# Altium schematic sheet LoRa-SX1281.SchDoc
size A3; SheetNumber: 4; SheetTotal: 5
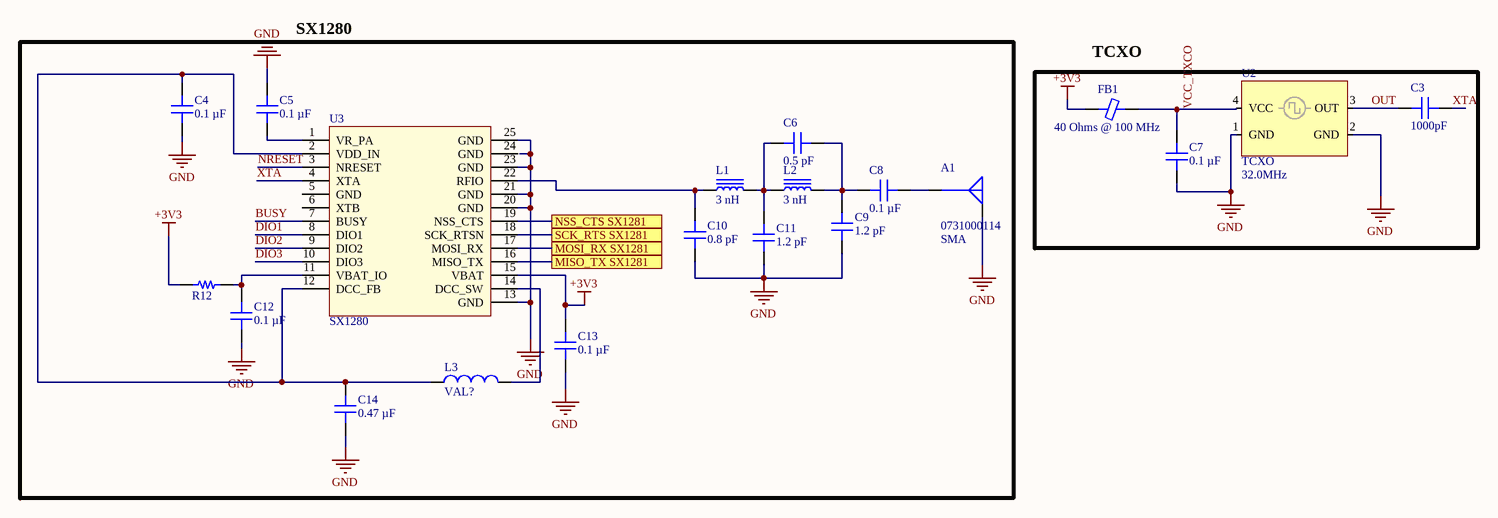
[diagram p0: LoRa-SX1281.SchDoc]

## Parts
A1  0731000114  Connector Style: SMA  [MOLEX SD-73100-0114]
C3  1000pF  [CAP 0402_1005]
C4  0.1 µF  [CAP 0402_1005]
C5  0.1 µF  [CAP 0402_1005]
C6  value 0.5 pF  [CAP 0402_1005]  (hidden comment: 0.5pF)
C7  value 0.1 µF  [CAP 0402_1005]  (hidden comment: 0.1µF)
C8  value 0.1 µF  [CAP 0402_1005]  (hidden comment: 0.1µF)
C9  1.2 pF  [CAP 0402_1005]
C10  value 0.8 pF  [CAP 0402_1005]  (hidden comment: 1.2 pF)
C11  value 1.2 pF  [CAP 0402_1005]  (hidden comment: 0.8pF)
C12  value 0.1 µF  [CAP 0402_1005]  (hidden comment: 0.1µF)
C13  value 0.1 µF  [CAP 0402_1005]  (hidden comment: 0.1µF)
C14  0.47 µF  [CAP 0402_1005]
FB1  40 Ohms @ 100 MHz  [FER 0402_1005]
L1  3 nH  [IND 0402_1005]
L2  3 nH  [IND 0402_1005]
L3  value VAL?  [rlc_805_smd]  (hidden comment: Inductor)
R12  (no value)  [RES 0402_1005]
U2  TCXO  value 32.0MHz  [TCXO 2.0x1.6mm]
U3  SX1280  [vqfn24_4x4mm]

## Blocks framed on the sheet
SX1280: A1 C4-C6 C8-C14 L1-L3 R12 U3
TCXO: C3 C7 FB1 U2

## Ports
MISO_TX SX1281, MOSI_RX SX1281, NSS_CTS SX1281, SCK_RTS SX1281

## Nets
+3V3: C13.2 FB1.1 R12.1 U3.15(VBAT)
GND: A1.G C4.1 C5.1 C7.1 C9.1 C10.1 C11.1 C12.1 C13.1 C14.1 U2.1(GND) U2.2(GND) U3.13(GND) U3.20(GND) U3.21(GND) U3.23(GND) U3.25(GND)
BUSY: U3.7(BUSY)
DIO1: U3.8(DIO1)
DIO2: U3.9(DIO2)
DIO3: U3.10(DIO3)
MISO_TX SX1281: U3.16(MISO_TX) ; port MISO_TX SX1281
MOSI_RX SX1281: U3.17(MOSI_RX) ; port MOSI_RX SX1281
NRESET: U3.3(NRESET)
NSS_CTS SX1281: U3.19(NSS_CTS) ; port NSS_CTS SX1281
OUT: C3.2 U2.3(OUT)
SCK_RTS SX1281: U3.18(SCK_RTSN) ; port SCK_RTS SX1281
VCC_TXCO: C7.2 FB1.2 U2.4(VCC)
XTA: C3.1 U3.4(XTA)
NetA1_S: A1.S C8.1
NetC4_2: C4.2 C14.2 L3.1 U3.2(VDD_IN) U3.12(DCC_FB)
NetC5_2: C5.2 U3.1(VR_PA)
NetC6_1: C6.1 C11.2 L1.2 L2.1
NetC6_2: C6.2 C8.2 C9.2 L2.2
NetC10_2: C10.2 L1.1 U3.22(RFIO)
NetC12_2: C12.2 R12.2 U3.11(VBAT_IO)
NetL3_2: L3.2 U3.14(DCC_SW)

Not connected (* = marked no-connect by the designer): U3 5(GND) 6(XTB) 24(GND)

## Library data of the parts
A1 = 0731000114: CONN SMA RCPT R/A 50 OHM PCB; Manufacturer: Molex; Connector Type: Receptacle, Female Socket; Contact Termination: Solder; Frequency - Max: 18 GHz; Impedance: 50Ohm; Number of Ports: 1; Part Number: 0731000114; ComponentLink1Description: Datasheet; ComponentLink1URL: https://www.molex.com/pdm_docs/sd/731000114_sd.pdf; ComponentLink2Description: DigiKey Link; ComponentLink2URL: https://www.digikey.com/en/products/detail/molex/0731000114/1465147; Fastening Type: Threaded; Housing Color: Gold; LastUpdated: 29.06.2022 18:00:24; Lifecycle Status: Active; Minimum Order: 1; Mounting Type: Through Hole, Right Angle; Packaging: Tray; Part Status: Active; Price: 3.19; Series: 73100; Shield Termination: Solder; Supplier 1: DigiKey; Supplier Part Number 1: WM5525-ND
C3 = 04025C102K4T2A: CAP CER 1000PF 50V X7R 0402; manufacturer: AVX Corporation; Tolerance: ±10%; Part Number: 04025C102K4T2A; Value: 1000pF; Applications: Automotive; Capacitance: 1000pF; componentlink1description: Datasheet; componentlink1url: http://datasheets.avx.com/AutoMLCC.pdf; componentlink2description: DigiKey Link; componentlink2url: http://digikey.com/product-detail/en/avx-corporation/04025C102K4T2A/478-11435-1-ND/8019290; Device Package: 0402 (1005 Metric); lastupdated: 8.02.2022 12:26:57; Lifecycle Status: Active; Minimum Order: 1; Mounting Type: Surface Mount, MLCC; Operating Temperature: -55°C ~ 125°C; Package / Case: 0402 (1005 Metric); packaging: TapeAndReel; partid: 2213; Part Status: Active; price: 0.02; Ratings: AEC-Q200; series: -; Size / Dimension: 0.039" L x 0.020" W (1.00mm x 0.50mm); Supplier 1: DigiKey; Supplier Part Number 1: 478-11435-1-ND; Temperature Coefficient: X7R; Thickness (Max): 0.022" (0.56mm); Voltage - Rated: 50V
C4 C5 = CC0402KRX7R8BB104: CAP CER 0.1UF 25V X7R 0402; manufacturer: Yageo; Tolerance: ±10%; Part Number: CC0402KRX7R8BB104; Value: 0.1 µF; Applications: General Purpose; Capacitance: 0.1 µF; componentlink1description: Datasheet; componentlink1url: https://www.yageo.com/upload/media/product/productsearch/datasheet/mlcc/UPY-GPHC_X7R_6.3V-to-50V_18.pdf; componentlink2description: DigiKey Link; componentlink2url: https://www.digikey.com/en/products/detail/yageo/CC0402KRX7R8BB104/5698946; Device Package: 0402 (1005 Metric); lastupdated: 27.02.2023 20:03:57; Lifecycle Status: Active; Minimum Order: 1; Mounting Type: Surface Mount, MLCC; Operating Temperature: -55°C ~ 125°C; Package / Case: 0402 (1005 Metric); packaging: TapeAndReel; partid: 12551; Part Status: Active; price: 0.01; series: CC; Size / Dimension: 0.039" L x 0.020" W (1.00mm x 0.50mm); Supplier 1: DigiKey; Supplier Part Number 1: 311-2077-1-ND; Temperature Coefficient: X7R; Thickness (Max): 0.022" (0.55mm); Voltage - Rated: 25V
C6 = GJM1555C1HR50BB01D: CAP CER 0.5PF 50V C0G/NP0 0402; manufacturer: Murata Electronics; Temperature Coefficient: C0G, NP0; Tolerance: ±0.1pF; Part Number: GJM1555C1HR50BB01D; Applications: RF, Microwave, High Frequency; Capacitance: 0.5 pF; componentlink1description: Datasheet; componentlink1url: https://search.murata.co.jp/Ceramy/image/img/A01X/G101/ENG/GJM1555C1HR50BB01-01.pdf; componentlink2description: DigiKey Link; componentlink2url: https://www.digikey.com/en/products/detail/murata-electronics/GJM1555C1HR50BB01D/2593250; Device Package: 0402 (1005 Metric); Features: High Q, Low Loss; lastupdated: 27.02.2023 20:04:06; Lifecycle Status: Active; Minimum Order: 1; Mounting Type: Surface Mount, MLCC; Operating Temperature: -55°C ~ 125°C; Package / Case: 0402 (1005 Metric); packaging: TapeAndReel; partid: 9579; Part Status: Active; price: 0.02; series: GJM; Size / Dimension: 0.039" L x 0.020" W (1.00mm x 0.50mm); Supplier 1: DigiKey; Supplier Part Number 1: 490-6077-1-ND; Thickness (Max): 0.022" (0.55mm); Voltage - Rated: 50V
C7 C8 C12 C13 = CL05B104KO5NNNC: CAP CER 0.1UF 16V X7R 0402; manufacturer: Samsung Electro-Mechanics; Tolerance: ±10%; Part Number: CL05B104KO5NNNC; Applications: General Purpose; Capacitance: 0.1 µF; componentlink1description: Datasheet; componentlink1url: http://www.samsungsem.com/kr/support/product-search/mlcc/CL05B104KO5NNNC.jsp; componentlink2description: DigiKey Link; componentlink2url: https://www.digikey.com/en/products/detail/samsung-electro-mechanics/CL05B104KO5NNNC/3886659; Device Package: 0402 (1005 Metric); lastupdated: 27.02.2023 20:04:18; Lifecycle Status: Active; Minimum Order: 1; Mounting Type: Surface Mount, MLCC; Operating Temperature: -55°C ~ 125°C; Package / Case: 0402 (1005 Metric); packaging: CutTape; partid: 6066; Part Status: Active; price: 0.01; series: CL; Size / Dimension: 0.039" L x 0.020" W (1.00mm x 0.50mm); Supplier 1: DigiKey; Supplier Part Number 1: 1276-1001-1-ND; Temperature Coefficient: X7R; Thickness (Max): 0.022" (0.55mm); Voltage - Rated: 16V
C9 C11 = CC0402BRNPO9BN1R2: CAP CER 1.2PF 50V C0G/NPO 0402; manufacturer: Yageo; Temperature Coefficient: C0G, NP0; Tolerance: ±0.1pF; Part Number: CC0402BRNPO9BN1R2; Applications: General Purpose; Capacitance: 1.2 pF; componentlink1description: Datasheet; componentlink1url: https://www.yageo.com/upload/media/product/productsearch/datasheet/mlcc/UPY-GP_NP0_16V-to-50V_17.pdf; componentlink2description: DigiKey Link; componentlink2url: https://www.digikey.com/en/products/detail/yageo/CC0402BRNPO9BN1R2/5195024; Device Package: 0402 (1005 Metric); lastupdated: 27.02.2023 20:03:57; Lifecycle Status: Active; Minimum Order: 1; Mounting Type: Surface Mount, MLCC; Operating Temperature: -55°C ~ 125°C; Package / Case: 0402 (1005 Metric); packaging: TapeAndReel; partid: 12585; Part Status: Active; price: 0.01; series: CC; Size / Dimension: 0.039" L x 0.020" W (1.00mm x 0.50mm); Supplier 1: DigiKey; Supplier Part Number 1: 311-1615-1-ND; Thickness (Max): 0.022" (0.55mm); Voltage - Rated: 50V
  C9: Value: 1.2 pF
C10 = CC0402BRNPO9BNR80: CAP CER 0.8PF 50V C0G/NPO 0402; manufacturer: Yageo; Temperature Coefficient: C0G, NP0; Tolerance: ±0.1pF; Part Number: CC0402BRNPO9BNR80; Applications: General Purpose; Capacitance: 0.8 pF; componentlink1description: Datasheet; componentlink1url: https://www.yageo.com/upload/media/product/productsearch/datasheet/mlcc/UPY-GP_NP0_16V-to-50V_17.pdf; componentlink2description: DigiKey Link; componentlink2url: https://www.digikey.com/en/products/detail/yageo/CC0402BRNPO9BNR80/5883200; Device Package: 0402 (1005 Metric); lastupdated: 27.02.2023 20:04:11; Lifecycle Status: Active; Minimum Order: 1; Mounting Type: Surface Mount, MLCC; Operating Temperature: -55°C ~ 125°C; Package / Case: 0402 (1005 Metric); packaging: TapeAndReel; partid: 8101; Part Status: Active; price: 0.01; series: CC; Size / Dimension: 0.039" L x 0.020" W (1.00mm x 0.50mm); Supplier 1: DigiKey; Supplier Part Number 1: 311-3711-1-ND; Thickness (Max): 0.022" (0.55mm); Voltage - Rated: 50V
C14 = CL05A474KP5NNNC: CAP CER 0.47UF 10V X5R 0402; manufacturer: Samsung Electro-Mechanics; Tolerance: ±10%; Part Number: CL05A474KP5NNNC; Value: 0.47 µF; Applications: General Purpose; Capacitance: 0.47 µF; componentlink1description: Datasheet; componentlink1url: http://www.samsungsem.com/kr/support/product-search/mlcc/CL05A474KP5NNNC.jsp; componentlink2description: DigiKey Link; componentlink2url: https://www.digikey.com/en/products/detail/samsung-electro-mechanics/CL05A474KP5NNNC/3886831; Device Package: 0402 (1005 Metric); lastupdated: 27.02.2023 20:04:27; Lifecycle Status: Active; Minimum Order: 1; Mounting Type: Surface Mount, MLCC; Operating Temperature: -55°C ~ 85°C; Package / Case: 0402 (1005 Metric); packaging: TapeAndReel; partid: 3144; Part Status: Active; price: 0.01; series: CL; Size / Dimension: 0.039" L x 0.020" W (1.00mm x 0.50mm); Supplier 1: DigiKey; Supplier Part Number 1: 1276-1173-1-ND; Temperature Coefficient: X5R; Thickness (Max): 0.022" (0.55mm); Voltage - Rated: 10V
FB1 = MMZ1005Y400CT000: FERRITE BEAD 40 OHM 0402 1LN; Manufacturer: TDK Corporation; Current Rating (Max): 550mA; DC Resistance (DCR) (Max): 100mOhm; Filter Type: Signal Line; Number of Lines: 1; Part Number: MMZ1005Y400CT000; ComponentLink1Description: Datasheet; ComponentLink1URL: https://product.tdk.com/info/en/catalog/datasheets/beads_commercial_signal_mmz1005_en.pdf?ref_disty=digikey; ComponentLink2Description: DigiKey Link; ComponentLink2URL: https://www.digikey.com/en/products/detail/tdk-corporation/MMZ1005Y400CT000/604108; Device Package: 0402 (1005 Metric); Height (Max): 0.022" (0.55mm); Impedance @ Frequency: 40 Ohms @ 100 MHz; LastUpdated: 25.02.2023 20:48:26; Lifecycle Status: Active; Minimum Order: 1; Mounting Type: Surface Mount; Operating Temperature: -55°C ~ 125°C; Package / Case: 0402 (1005 Metric); Packaging: TapeAndReel; PartId: 480; Part Status: Active; Price: 0.02; Series: MMZ; Size / Dimension: 0.039" L x 0.020" W (1.00mm x 0.50mm); Supplier 1: DigiKey; Supplier Part Number 1: 445-2150-1-ND; Value: 40 Ohms @ 100 MHz
L1 L2 = LQW15AN3N0B80D: FIXED IND 3NH 1.35A 63 MOHM SMD; Manufacturer: Murata Electronics; DC Resistance (DCR): 63mOhm Max; Frequency - Self Resonant: 12.5GHz; Inductance Frequency - Test: 100 MHz; Material - Core: Non-Magnetic; Q @ Freq: 20 @ 250MHz; Shielding: Unshielded; Tolerance: ±0.1nH; Type: Wirewound; Part Number: LQW15AN3N0B80D; ComponentLink1Description: Datasheet; ComponentLink1URL: https://search.murata.co.jp/Ceramy/image/img/P02/JELF243A-0100.pdf; ComponentLink2Description: DigiKey Link; ComponentLink2URL: https://www.digikey.com/en/products/detail/murata-electronics/LQW15AN3N0B80D/4905926; Current Rating (Amps): 1.35 A; Device Package: 0402 (1005 Metric); Height - Seated (Max): 0.024" (0.60mm); Inductance: 3 nH; LastUpdated: 25.02.2023 21:01:34; Lifecycle Status: Active; Minimum Order: 1; Mounting Type: Surface Mount; Operating Temperature: -55°C ~ 125°C; Package / Case: 0402 (1005 Metric); Packaging: TapeAndReel; PartId: 4894; Part Status: Active; Price: 0.07; Series: LQW15; Size / Dimension: 0.039" L x 0.024" W (1.00mm x 0.60mm); Supplier 1: DigiKey; Supplier Part Number 1: 490-14712-1-ND; Value: 3 nH
L3 = Inductor_1: Inductor SMD; Code_IEC: 1005; Published: 8-Jun-2000; LatestRevisionDate: 05-oct-2007  -  Semtech; LatestRevisionNote: Re-released for DXP Platform.; Publisher: Altium Limited; Code_JEITA: 0402
R12 = CRCW04020000Z0ED: RES SMD 0 OHM JUMPER 1/16W 0402; Manufacturer: Vishay Dale; Power (Watts): 0.063W, 1/16W; Part Number: CRCW04020000Z0ED; ComponentLink1Description: Datasheet; ComponentLink1URL: http://www.vishay.com/docs/20035/dcrcwe3.pdf; ComponentLink2Description: DigiKey Link; ComponentLink2URL: http://digikey.com/product-detail/en/vishay-dale/CRCW04020000Z0ED/541-0.0JCT-ND/1182611; Composition: Thick Film; Device Package: 0402 (1005 Metric); Features: Automotive AEC-Q200; Height - Seated (Max): 0.016" (0.40mm); LastUpdated: 14.02.2022 15:03:58; Lifecycle Status: Active; Minimum Order: 1; Number of Terminations: 2; Operating Temperature: -55°C ~ 155°C; Package / Case: 0402 (1005 Metric); Packaging: CutTape; PartId: 17634; Part Status: Active; Price: 0.10; Ratings: AEC-Q200; Series: CRCW; Size / Dimension: 0.039" L x 0.020" W (1.00mm x 0.50mm); Supplier 1: DigiKey; Supplier Part Number 1: 541-0.0JCT-ND; Supplier Device Package: 0402; Tolerance: Jumper
U3 = SX1280: SX1280 - Ultra low power RF transceiver